# EasyEDA schematic EasyEDA-Schematic.json
TITLE: AVR ZIF programming socket; REV: 1.0; Date: 2018-01-04; Sheet: 1/1; Drawn By: Julian Schuler
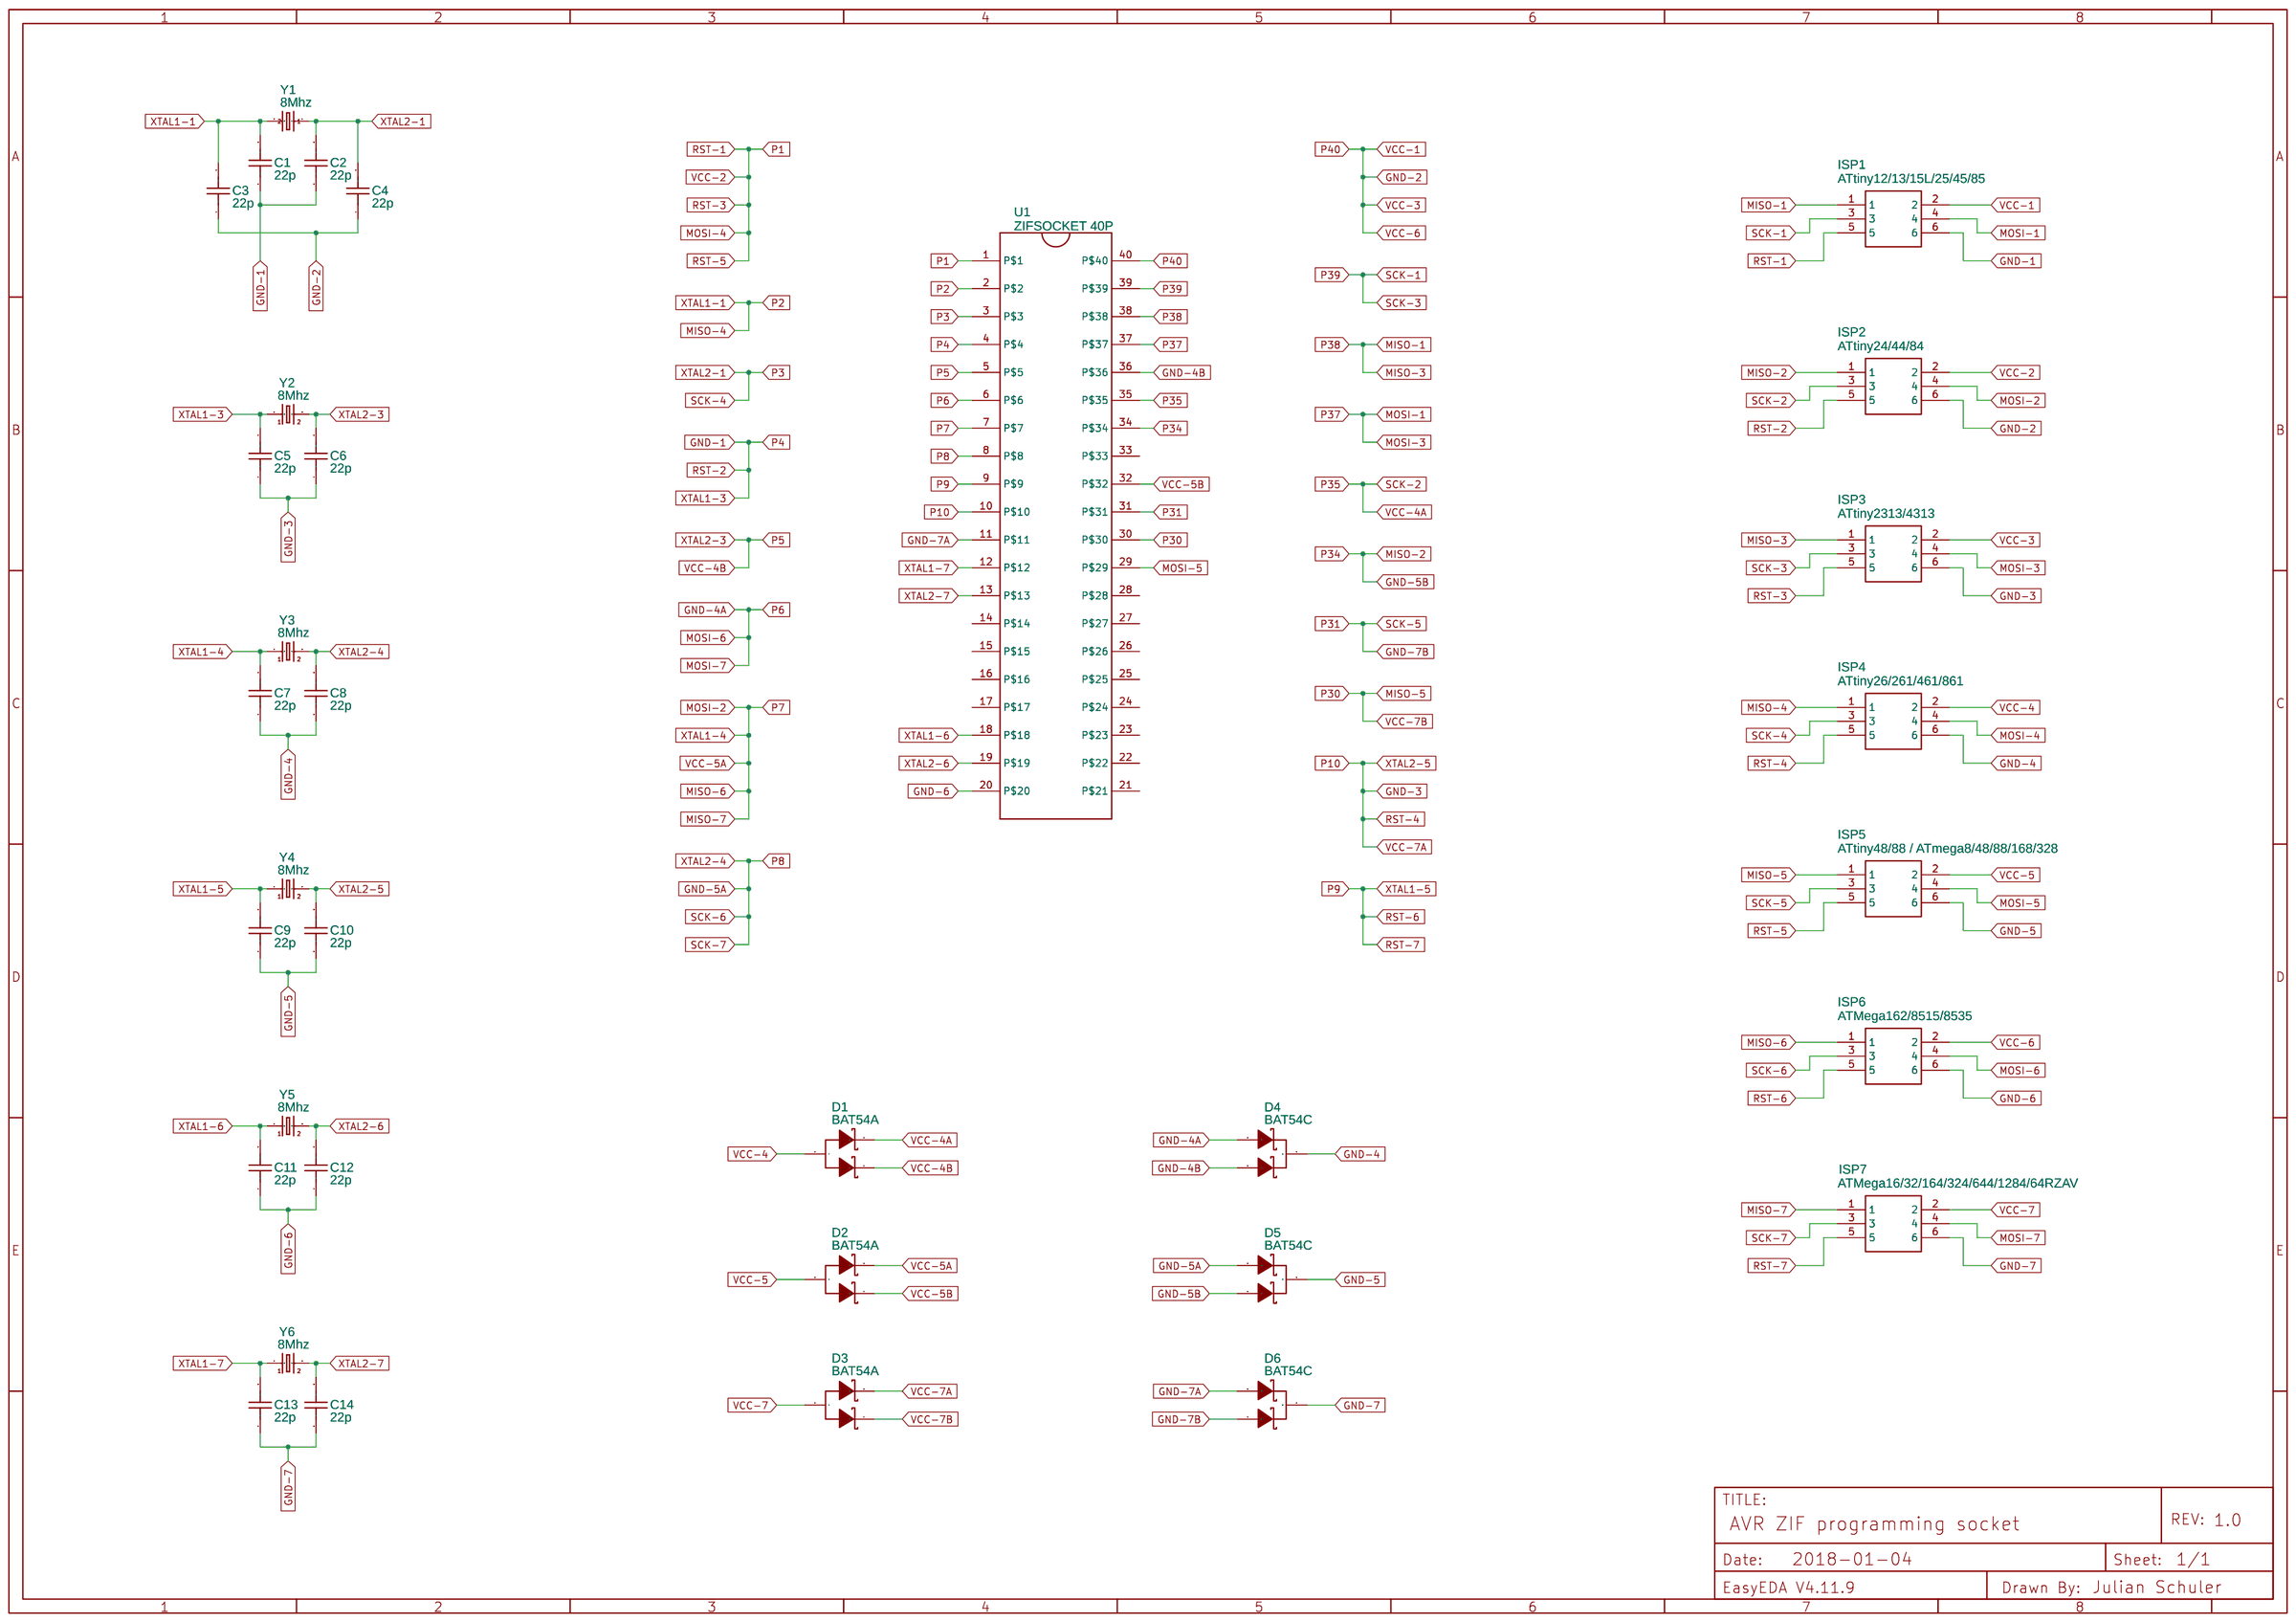
[diagram p0: schematic sheet]

## Parts
C1  22p  [0603]
C2  22p  [0603]
C3  22p  [0603]
C4  22p  [0603]
C5  22p  [0603]
C6  22p  [0603]
C7  22p  [0603]
C8  22p  [0603]
C9  22p  [0603]
C10  22p  [0603]
C11  22p  [0603]
C12  22p  [0603]
C13  22p  [0603]
C14  22p  [0603]
D1  BAT54A  [SOT-23(SOT-23-3)]
D2  BAT54A  [SOT-23(SOT-23-3)]
D3  BAT54A  [SOT-23(SOT-23-3)]
D4  BAT54C  [SOT-23(SOT-23-3)]
D5  BAT54C  [SOT-23(SOT-23-3)]
D6  BAT54C  [SOT-23(SOT-23-3)]
ISP1  ATtiny12/13/15L/25/45/85  [HDR-IDC-2.54-2X3P]
ISP2  ATtiny24/44/84  [HDR-IDC-2.54-2X3P]
ISP3  ATtiny2313/4313  [HDR-IDC-2.54-2X3P]
ISP4  ATtiny26/261/461/861  [HDR-IDC-2.54-2X3P]
ISP5  ATtiny48/88 / ATmega8/48/88/168/328  [HDR-IDC-2.54-2X3P]
ISP6  ATMega162/8515/8535  [HDR-IDC-2.54-2X3P]
ISP7  ATMega16/32/164/324/644/1284/64RZAV  [HDR-IDC-2.54-2X3P]
U1  ZIFSOCKET 40P  [ZIF SOCKET 40 PIN]
Y1  8Mhz  [HC49US]
Y2  8Mhz  [HC49US]
Y3  8Mhz  [HC49US]
Y4  8Mhz  [HC49US]
Y5  8Mhz  [HC49US]
Y6  8Mhz  [HC49US]

## Library data of the parts
C1-C14 = Cap_RAD-0.1_US: Manufacturer Part: ?
D1-D3 = -: Supplier: LCSC; Manufacturer: SEMTECH; image: //image.lceda.cn/szlcsc/C83936.jpg; Supplier Part: C83936; LCSC Assembly: Yes; SMT Type: Extend
D4-D6 = -: Supplier: LCSC; Manufacturer: SEMTECH; Manufacturer Part: BAT54C(L43); Supplier Part: C118748; LCSC Assembly: Yes; SMT Type: Extend
ISP1-ISP7 = -: Supplier: LCSC; Manufacturer: ReliaPro; Manufacturer Part: 2X3 2.54mm IDC Box; Supplier Part: C11214
U1 = -: catid: 20; Contributor: SparkFun; Manufacturer Part: ?
Y1-Y6 = -: DIP Crystal 16MHz-18pF-30ppm-50R;; catid: 20; Manufacturer Part: 49S/18PF

## Nets
GND-1: C1.1 C2.1 C5.2 ISP1.6 ISP2.5 U1.4(P$4) Y2.1
GND-2: C3.1 C4.1 ISP1.2 ISP2.6 ISP3.2 ISP6.2 U1.40(P$40)
GND-3: C5.1 C6.1 C10.2 D3.2(K2) ISP3.6 ISP4.5 U1.10(P$10) Y4.2
GND-4: C7.1 C8.1 D4.3 ISP4.6
GND-4A: D4.2 ISP6.4 ISP7.4 U1.6(P$6)
GND-4B: D4.1 U1.36(P$36)
GND-5: C9.1 C10.1 D5.3 ISP5.6
GND-5A: C8.2 D5.2 ISP6.3 ISP7.3 U1.8(P$8) Y3.2
GND-5B: D5.1 ISP2.1 U1.34(P$34)
GND-6: C11.1 C12.1 ISP6.6 U1.20(P$20)
GND-7: C13.1 C14.1 D6.3 ISP7.6
GND-7A: D6.2 U1.11(P$11)
GND-7B: D6.1 ISP5.3 U1.31(P$31)
VCC-4: D1.3(A) ISP4.2
VCC-5: D2.3(A) ISP5.2
VCC-5B: D2.1(K1) U1.32(P$32)
VCC-7: D3.3(A) ISP7.2
MISO-1: ISP1.1 ISP3.1 U1.38(P$38)
MISO-4: C1.2 C3.2 ISP4.1 U1.2(P$2) Y1.2
MISO-5: D3.1(K1) ISP5.1 U1.30(P$30)
MISO-6: C7.2 D2.2(K2) ISP2.4 ISP6.1 ISP7.1 U1.7(P$7) Y3.1
MOSI-1: ISP1.4 ISP3.4 U1.37(P$37)
MOSI-4: ISP1.5 ISP2.2 ISP3.5 ISP4.4 ISP5.5 U1.1(P$1)
MOSI-5: ISP5.4 U1.29(P$29)
P3: C2.2 C4.2 ISP4.3 U1.3(P$3) Y1.1
P5: C6.2 D1.1(K1) U1.5(P$5) Y2.2
P9: C9.2 ISP6.5 ISP7.5 U1.9(P$9) Y4.1
P35: D1.2(K2) ISP2.3 U1.35(P$35)
P39: ISP1.3 ISP3.3 U1.39(P$39)
XTAL1-6: C11.2 U1.18(P$18) Y5.1
XTAL1-7: C13.2 U1.12(P$12) Y6.1
XTAL2-6: C12.2 U1.19(P$19) Y5.2
XTAL2-7: C14.2 U1.13(P$13) Y6.2

Not connected (* = marked no-connect by the designer): U1 14(P$14) 15(P$15) 16(P$16) 17(P$17) 21(P$21) 22(P$22) 23(P$23) 24(P$24) 25(P$25) 26(P$26) 27(P$27) 28(P$28) 33(P$33)
